# Altium project UAARG Autopilot.PrjPcb (part 2 of 3)

## Sheet IMU.SchDoc
size A; DocumentNumber: 5; SheetNumber: 5; SheetTotal: 16
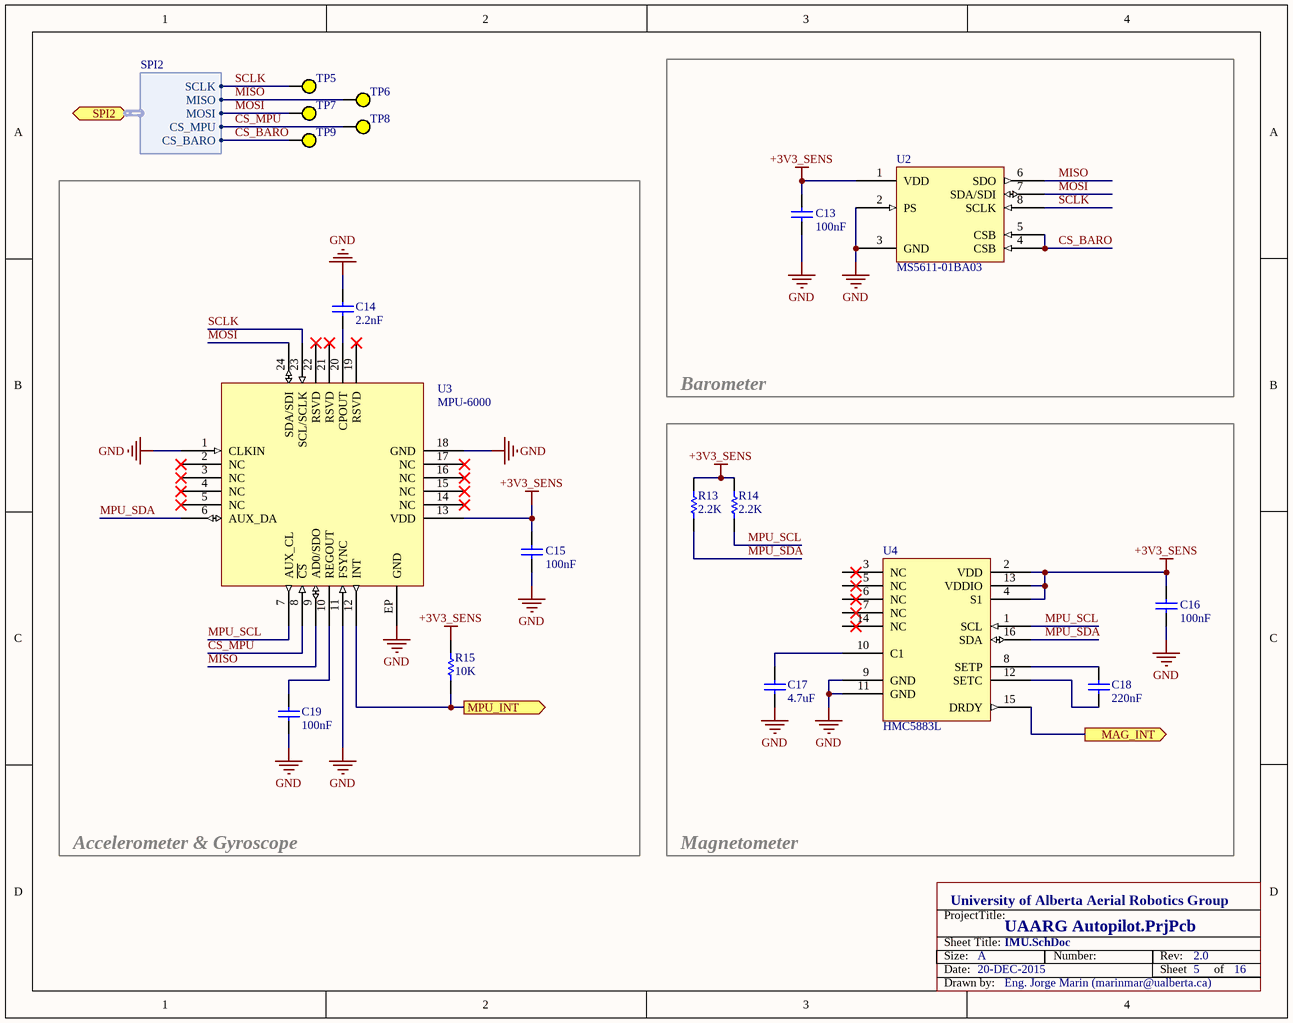
[diagram p9: IMU.SchDoc]

### Parts
C13  value 100nF  [CAP_0402[1005M]]  (hidden comment: Cap)
C14  value 2.2nF  [CAP_0402[1005M]]  (hidden comment: CAP)
C15  value 100nF  [CAP_0402[1005M]]  (hidden comment: Cap)
C16  value 100nF  [CAP_0402[1005M]]  (hidden comment: Cap)
C17  value 4.7uF  [CAP_0402[1005M]]  (hidden comment: Cap)
C18  value 220nF  [CAP_0402[1005M]]  (hidden comment: Cap)
C19  value 100nF  [CAP_0402[1005M]]  (hidden comment: Cap)
R13  value 2.2K  [RES_0402[1005M]]  (hidden comment: RES)
R14  value 2.2K  [RES_0402[1005M]]  (hidden comment: RES)
R15  value 10K  [RES_0402[1005M]]  (hidden comment: RES)
TP5  Test Point SIG  [TP_SMD_1_SILK]  (value not drawn)  (no BOM)
TP6  Test Point SIG  [TP_SMD_1_SILK]  (value not drawn)  (no BOM)
TP7  Test Point SIG  [TP_SMD_1_SILK]  (value not drawn)  (no BOM)
TP8  Test Point SIG  [TP_SMD_1_SILK]  (value not drawn)  (no BOM)
TP9  Test Point SIG  [TP_SMD_1_SILK]  (value not drawn)  (no BOM)
U2  MS5611-01BA03  [MS5611-01BA03]
U3  MPU-6000  [QFN24]
U4  HMC5883L  [QFN16]

### Blocks framed on the sheet
Barometer: C13 U2
Accelerometer & Gyroscope: C14 C15 C19 R15 U3
Magnetometer: C16-C18 R13 R14 U4

### Ports
MAG_INT (out), MPU_INT (out), SPI2 (harness SPI2)

### Harnesses
SPI2: SCLK, MOSI, MISO, CS_MPU, CS_BARO

### Nets
+3V3_SENS: C13.1 C15.1 C16.1 R13.2 R14.2 R15.2 U2.1(VDD) U3.13(VDD) U4.2(VDD) U4.4(S1) U4.13(VDDIO)
GND: C13.2 C14.2 C15.2 C16.2 C17.2 C19.1 U2.2(PS) U2.3(GND) U3.1(CLKIN) U3.11(FSYNC) U3.18(GND) U3.EP(GND) U4.9(GND) U4.11(GND)
CS_BARO: TP9.1 U2.4(CSB) U2.5(CSB) ; port SPI2.CS_BARO
CS_MPU: TP8.1 U3.8(~{CS}) ; port SPI2.CS_MPU
MAG_INT: U4.15(DRDY) ; port MAG_INT
MISO: TP6.1 U2.6(SDO) U3.9(AD0/SDO) ; port SPI2.MISO
MOSI: TP7.1 U2.7(SDA/SDI) U3.24(SDA/SDI) ; port SPI2.MOSI
MPU_INT: R15.1 U3.12(INT) ; port MPU_INT
MPU_SCL: R14.1 U3.7(AUX_CL) U4.1(SCL)
MPU_SDA: R13.1 U3.6(AUX_DA) U4.16(SDA)
SCLK: TP5.1 U2.8(SCLK) U3.23(SCL/SCLK) ; port SPI2.SCLK  [project net PB13]
NetC14_1: C14.1 U3.20(CPOUT)
NetC17_1: C17.1 U4.10(C1)
NetC18_1: C18.1 U4.8(SETP)
NetC18_2: C18.2 U4.12(SETC)
NetC19_2: C19.2 U3.10(REGOUT)

Not connected (* = marked no-connect by the designer): U3 2(NC)* 3(NC)* 4(NC)* 5(NC)* 14(NC)* 15(NC)* 16(NC)* 17(NC)* 19(RSVD)* 21(RSVD)* 22(RSVD)*; U4 3(NC) 5(NC) 6(NC) 7(NC) 14(NC)

### Notes on the sheet
- Sheet Title:
- ProjectTitle:
- Size:
- Date:
- A
- Number:
- Rev:
- Sheet         of
- Drawn by:

### Library data of the parts
C13 C15 C16 C19 = Cap: as C20 on sheet CAN, JTAG, LDO, USB; Supplier 1: Digi-Key; Supplier Part Number 1: 311-1345-1-ND; ComponentLink1URL: http://www.yageo.com/documents/recent/UPY-GPHC_X7R_6.3V-to-50V-v12.pdf; ComponentLink1Description: Datasheet
C14 = CAP: Capacitor; Manufacturer: Yageo; Manufacturer Part Number: CC0402KRX7R9BB222; Supplier 1: Digi-Key; Supplier Part Number 1: 311-1037-1-ND; ComponentLink1URL: http://www.yageo.com/documents/recent/UPY-GPHC_X7R_6.3V-to-50V-v12.pdf; ComponentLink1Description: Datasheet
C17 = Cap: Capacitor; Manufacturer: Yageo; Manufacturer Part Number: CC0402MRX5R6BB475; Supplier 1: Digi-Key; Supplier Part Number 1: 311-1734-1-ND; ComponentLink1URL: http://www.yageo.com/documents/recent/UPY-GPHC_X5R_4V-to-50V_19.pdf; ComponentLink1Description: Datasheet
C18 = Cap: Capacitor; Manufacturer: Yageo; Manufacturer Part Number: CC0402KRX5R5BB224; Supplier 1: Digi-Key; Supplier Part Number 1: 311-1681-1-ND; ComponentLink1URL: http://www.yageo.com/documents/recent/UPY-GPHC_X5R_4V-to-50V_19.pdf; ComponentLink1Description: Datasheet
R13 R14 = RES: Resistor; Manufacturer Part Number: RC0402FR-072K2L; Manufacturer: Yageo; Supplier 1: Digi-Key; Supplier Part Number 1: 311-2.20KLRCT-ND; ComponentLink1URL: http://www.yageo.com/NewPortal/yageodocoutput?fileName=/pdf/R-Chip/PYu-RC_Group_51_RoHS_L_3.pdf; ComponentLink1Description: Datasheet
R15 = RES: Resistor; Manufacturer: Yageo; Manufacturer Part Number: RC0402FR-0710KL; Supplier 1: Digi-Key; Supplier Part Number 1: 311-10.0KLRCT-ND; ComponentLink1URL: http://www.yageo.com/NewPortal/yageodocoutput?fileName=/pdf/R-Chip/PYu-RC_Group_51_RoHS_L_3.pdf; ComponentLink1Description: Datasheet
TP5-TP9 = Test Point SIG: Test Point Signal
U2 = MS5611-01BA03: MS5611-01BA03 Barometer, Altimeter; Manufacturer: Measurement Specialties, Inc.; Manufacturer Part Number: MS5611-01BA03; Supplier 2: Component Distributors, Inc.; Supplier Part Number 2: MS5611-01BA03; Supplier 4: Newark; Supplier Part Number 4: 20X0212; ComponentLink1URL: http://www.mouser.com/ds/2/418/MS5611-01BA03-769655.pdf; ComponentLink1Description: Datasheet; Supplier 3: Mouser; Supplier Part Number 3: 824-MS561101BA03-00; Supplier 1: Digi-Key; Supplier Part Number 1: 223-1622-1-ND
U3 = MPU-6000: Invense MPU-6000 6 Axis Motion Sensor; Manufacturer: InvenSense; Manufacturer Part Number: MPU-6000; Supplier 2: InvenSense; Supplier Part Number 2: MPU-6000; Supplier 1: Digi-Key; Supplier Part Number 1: 1428-1005-2-ND; ComponentLink1URL: http://store.invensense.com/datasheets/invensense/MPU-6050_DataSheet_V3%204.pdf; ComponentLink1Description: Datasheet
U4 = HMC5883L: HMC5883L 3-axis Magnetometer; Manufacturer: Honeywell Microelectronics & Precision Sensors; Manufacturer Part Number: HMC5883L-TR; Supplier 1: Digi-Key; Supplier Part Number 1: 342-1082-1-ND; ComponentLink1URL: http://www51.honeywell.com/aero/common/documents/myaerospacecatalog-documents/Defense_Brochures-documents/HMC5883L_3-Axis_Digital_Compass_IC.pdf; ComponentLink1Description: Datasheet

## Sheet GPS.SchDoc
size A; DocumentNumber: 6; SheetNumber: 6; SheetTotal: 16
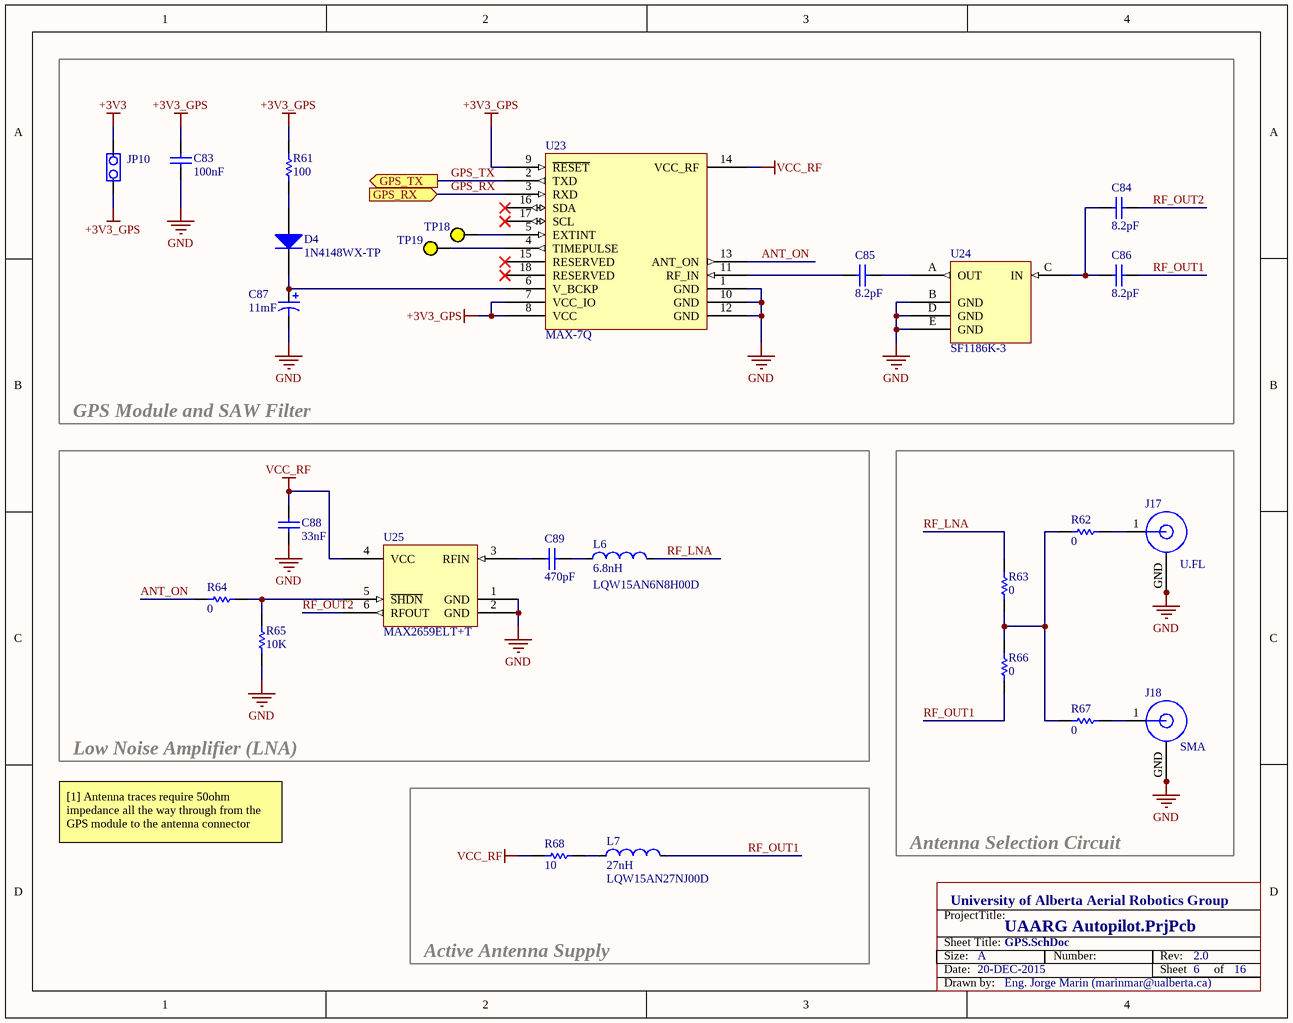
[diagram p10: GPS.SchDoc]

### Parts
C83  value 100nF  [CAP_0402[1005M]]  (hidden comment: Cap)
C84  value 8.2pF  [CAP_0402[1005M]]  (hidden comment: Cap)
C85  value 8.2pF  [CAP_0402[1005M]]  (hidden comment: Cap)
C86  value 8.2pF  [CAP_0402[1005M]]  (hidden comment: Cap)
C87  value 11mF  [SUPERCAP_1210[3225M]]  (hidden comment: CAP_POL)
C88  value 33nF  [CAP_0402[1005M]]  (hidden comment: Cap)
C89  value 470pF  [CAP_0402[1005M]]  (hidden comment: Cap)
D4  Manufacturer Part Number: 1N4148WX-TP  [SOD-323]  (hidden comment: DIODE)
J17  U.FL  [U.FL_1]
J18  SMA  [SMA]
JP10  Jumper  [HDR_1x02_JMP]  (value not drawn)  (no BOM)
L6  6.8nH  Manufacturer Part Number: LQW15AN6N8H00D  [GEN_0402[1005M]]
L7  27nH  Manufacturer Part Number: LQW15AN27NJ00D  [GEN_0402[1005M]]
R61  value 100  [RES_0402[1005M]]  (hidden comment: RES)
R62  value 0  [RES_0402[1005M]]  (hidden comment: RES)
R63  value 0  [RES_0402[1005M]]  (hidden comment: RES)
R64  value 0  [RES_0402[1005M]]  (hidden comment: RES)
R65  value 10K  [RES_0402[1005M]]  (hidden comment: RES)
R66  value 0  [RES_0402[1005M]]  (hidden comment: RES)
R67  value 0  [RES_0402[1005M]]  (hidden comment: RES)
R68  value 10  [RES_0402[1005M]]  (hidden comment: RES)
TP18  Test Point SIG  [TP_SMD_1_SILK]  (value not drawn)  (no BOM)
TP19  Test Point SIG  [TP_SMD_1_SILK]  (value not drawn)  (no BOM)
U23  MAX-7Q  [MAX6/7_GPS]
U24  SF1186K-3  [5-SMD]
U25  MAX2659ELT+T  [uDFN-6]

### Blocks framed on the sheet
GPS Module and SAW Filter: C83-C87 D4 JP10 R61 TP18 TP19 U23 U24
Low Noise Amplifier (LNA): C88 C89 L6 R64 R65 U25
Antenna Selection Circuit: J17 J18 R62 R63 R66 R67
Active Antenna Supply: L7 R68

### Ports
GPS_RX (in), GPS_TX (out)

### Nets
+3V3: JP10.2
+3V3_GPS: C83.2 JP10.1 R61.1 U23.7(VCC_IO) U23.8(VCC) U23.9(~{RESET})
GND: C83.1 C87.2 C88.2 J17.GND J18.GND R65.1 U23.1(GND) U23.10(GND) U23.12(GND) U24.B(GND) U24.D(GND) U24.E(GND) U25.1(GND) U25.2(GND)
VCC_RF: C88.1 R68.1 U23.14(VCC_RF) U25.4(VCC)
ANT_ON: R64.1 U23.13(ANT_ON)
GPS_RX: U23.3(RXD) ; port GPS_RX
GPS_TX: U23.2(TXD) ; port GPS_TX
RF_LNA: L6.2 R63.2
RF_OUT1: C86.1 L7.2 R66.1
RF_OUT2: C84.1 U25.6(RFOUT)
NetC84_2: C84.2 C86.2 U24.C(IN)
NetC85_1: C85.1 U24.A(OUT)
NetC85_2: C85.2 U23.11(RF_IN)
NetC87_1: C87.1 D4.2(K) U23.6(V_BCKP)
NetC89_1: C89.1 L6.1
NetC89_2: C89.2 U25.3(RFIN)
NetD4_1: D4.1(A) R61.2
NetJ17_1: J17.1(OSC1) R62.1
NetJ18_1: J18.1(OSC1) R67.1
NetL7_1: L7.1 R68.2
NetR62_2: R62.2 R63.1 R66.2 R67.2
NetR64_2: R64.2 R65.2 U25.5(~{SHDN})
NetTP18_1: TP18.1 U23.5(EXTINT)
NetTP19_1: TP19.1 U23.4(TIMEPULSE)

Not connected (* = marked no-connect by the designer): U23 15(RESERVED)* 16(SDA)* 17(SCL)* 18(RESERVED)*

### Notes on the sheet
- [1] Antenna traces require 50ohm impedance all the way through from the GPS module to the antenna connector
- Sheet Title:
- ProjectTitle:
- Size:
- Date:
- A
- Number:
- Rev:
- Sheet         of
- Drawn by:

### Library data of the parts
C83 = Cap: as C20 on sheet CAN, JTAG, LDO, USB; Supplier 1: Digi-Key; Supplier Part Number 1: 311-1345-1-ND; ComponentLink1URL: http://www.yageo.com/documents/recent/UPY-GPHC_X7R_6.3V-to-50V-v12.pdf; ComponentLink1Description: Datasheet
C84-C86 = Cap: Capacitor; Manufacturer: Yageo; Manufacturer Part Number: CC0402BRNPO9BN8R2; Supplier 1: Digi-Key; Supplier Part Number 1: 311-1628-1-ND; ComponentLink1URL: http://www.yageo.com/documents/recent/UPY-GP_NP0_16V-to-50V_10.pdf; ComponentLink1Description: Datasheet
C87 = CAP_POL: Polarized Capacitor; Manufacturer: Seiko Instruments; Manufacturer Part Number: CPH3225A; Supplier 1: Digi-Key; Supplier Part Number 1: 728-1067-1-ND; ComponentLink1URL: http://media.digikey.com/pdf/Data%20Sheets/Seiko%20Instruments%20PDFs/CPH3225A_CP3225A.pdf; ComponentLink1Description: Datasheet
C88 = Cap: Capacitor; Manufacturer Part Number: CL05B333JO5NNNC; Manufacturer: Samsung Electro-Mechanics America, Inc.; Supplier 1: Digi-Key; Supplier Part Number 1: 1276-1553-1-ND; ComponentLink1URL: http://www.samsungsem.com/kr/support/product-search/mlcc/CL05B333JO5NNNC.jsp; ComponentLink1Description: Datasheet
C89 = Cap: Capacitor; Manufacturer Part Number: C1005C0G1H471J050BA; Manufacturer: TDK Corporation; Supplier 1: Digi-Key; Supplier Part Number 1: 445-2656-1-ND; ComponentLink1URL: http://product.tdk.com/en/catalog/datasheets/mlcc_commercial_general_en.pdf; ComponentLink1Description: Datasheet
D4 = DIODE: Typical Diode; Manufacturer: Micro Commercial Co; Current - Reverse Leakage @ Vr: 5µA @ 75V; Current - Average Rectified (Io): 150mA; Supplier 1: Digi-Key; Supplier Part Number 1: 1N4148WXTPMSCT-ND; ComponentLink1URL: http://www.mccsemi.com/up_pdf/1N4148WX(SOD323).pdf; ComponentLink1Description: Datasheet
J17 = U.FL: U.FL RF connector; Manufacturer: Hirose Electric Co Ltd; Manufacturer Part Number: U.FL-R-SMT(10); Impedance: 50 Ohm; Supplier 1: Digi-Key; Supplier Part Number 1: H9161CT-ND; ComponentLink1URL: http://media.digikey.com/pdf/Data%20Sheets/Hirose%20PDFs/UFL%20Series.pdf; ComponentLink1Description: Datasheet
J18 = U.FL: SMA RF connector; Manufacturer: Cinch Connectivity Solutions Johnson; Manufacturer Part Number: 142-0701-801; Dielectric Material: Polytetrafluoroethylene (PTFE); Frequency - Max: 18GHz; Impedance: 50 Ohm; Connector Type: Jack, Female Socket; Supplier 1: Digi-Key; Supplier Part Number 1: J502-ND; ComponentLink1URL: http://cinchconnectivity.com/OA_MEDIA/drawings/dr-1420701801.pdf; ComponentLink1Description: Datasheet; Fastening Type: Threaded; Connector Style: SMA
L6 = Inductor: Chip Inductor; Manufacturer: Murata Electronics North America; Q @ Freq: 25 @ 250MHz; Frequency - Test: 100MHz; Frequency - Self Resonant: 6GHz; DC Resistance (DCR): 90 mOhm Max; Current Rating: 700mA; Value: 6.8nH; Supplier 1: Digi-Key; Supplier Part Number 1: 490-6841-1-ND; ComponentLink1URL: http://search.murata.co.jp/Ceramy/image/img/PDF/ENG/L0075S0080LQW15A_00.pdf; ComponentLink1Description: Datasheet
L7 = Inductor: Chip Inductor; Manufacturer: Murata Electronics North America; Q @ Freq: 25 @ 250MHz; DC Resistance (DCR): 520 mOhm Max; Frequency - Self Resonant: 3.5GHz; Frequency - Test: 100MHz; Current Rating: 280mA; Value: 27nH; ComponentLink1URL: http://search.murata.co.jp/Ceramy/image/img/PDF/ENG/L0075S0080LQW15A_00.pdf; ComponentLink1Description: Datasheet; Supplier 1: Digi-Key; Supplier Part Number 1: 490-1151-1-ND
R61 = RES: Resistor; Manufacturer Part Number: RC0402FR-07100RL; Manufacturer: Yageo; Supplier 1: Digi-Key; Supplier Part Number 1: 311-100LRCT-ND; ComponentLink1URL: http://www.yageo.com/NewPortal/yageodocoutput?fileName=/pdf/R-Chip/PYu-RC_Group_51_RoHS_L_3.pdf; ComponentLink1Description: Datasheet
R62-R64 R66 R67 = RES: as R1 on sheet UAARG Autopilot; Supplier 1: Digi-Key; Supplier Part Number 1: 311-0.0JRCT-ND; ComponentLink1URL: http://www.yageo.com/NewPortal/yageodocoutput?fileName=/pdf/R-Chip/PYu-RC_Group_51_RoHS_L_3.pdf; ComponentLink1Description: Datasheet
R65 = RES: as R15 on sheet IMU; Supplier 1: Digi-Key; Supplier Part Number 1: 311-10.0KLRCT-ND; ComponentLink1URL: http://www.yageo.com/NewPortal/yageodocoutput?fileName=/pdf/R-Chip/PYu-RC_Group_51_RoHS_L_3.pdf; ComponentLink1Description: Datasheet
R68 = RES: Resistor; Manufacturer: Yageo; Manufacturer Part Number: RC0402FR-0710RL; Supplier 1: Digi-Key; Supplier Part Number 1: 311-10.0LRCT-ND; ComponentLink1URL: http://www.yageo.com/NewPortal/yageodocoutput?fileName=/pdf/R-Chip/PYu-RC_Group_51_RoHS_L_3.pdf; ComponentLink1Description: Datasheet
TP18 TP19 = Test Point SIG: Test Point Signal
U23 = MAX-7Q: u-blox MAX-7Q GNSS Module; Manufacturer: u-blox; Supplier 1: u-blox; Supplier Part Number 1: MAX-7Q; Manufacturer Part Number: MAX-7Q; ComponentLink1Description: Datasheet; ComponentLink1URL: https://www.u-blox.com/sites/default/files/products/documents/MAX-7_DataSheet_(UBX-13004068).pdf; ComponentLink2Description: Manufacturer URL; ComponentLink2URL: https://www.u-blox.com/en/product/max-7-series
U24 = SF1186K-3: GPS SAW Filter; Manufacturer: Murata Electronics North America; Bandwidth: 40MHz; Insertion Loss: 0.9dB; Filter Type: Band Pass; Frequency: 1575.42MHz Center; Supplier 1: Digi-Key; Supplier Part Number 1: 583-1182-1-ND; Package / Case: 5-SMD, No Lead; Applications: GPS; Manufacturer Part Number: SF1186K-3; Size / Dimension: 0.057" L x 0.045" W (1.45mm x 1.15mm); ComponentLink1URL: http://www.rfmchina.com/prouplod/prodt/sf1186k-3.pdf; ComponentLink1Description: Datasheet
U25 = MAX2659: MAX2659 Low Noise Amplifier; Manufacturer: Maxim Integrated; Gain: 20.5dB; Frequency: 1575.42MHz; Current - Supply: 4.1mA; Voltage - Supply: 1.6 V ~ 3.3 V; Supplier 1: Digi-Key; Supplier Part Number 1: MAX2659ELT+TCT-ND; Manufacturer Part Number: MAX2659ELT+T; Package / Case: 6-WFDFN; ComponentLink1URL: http://datasheets.maximintegrated.com/en/ds/MAX2659.pdf; ComponentLink1Description: Datasheet

## Sheet Connectors.SchDoc
size 355 x 228 mm; DocumentNumber: 3; SheetNumber: 3; SheetTotal: 16
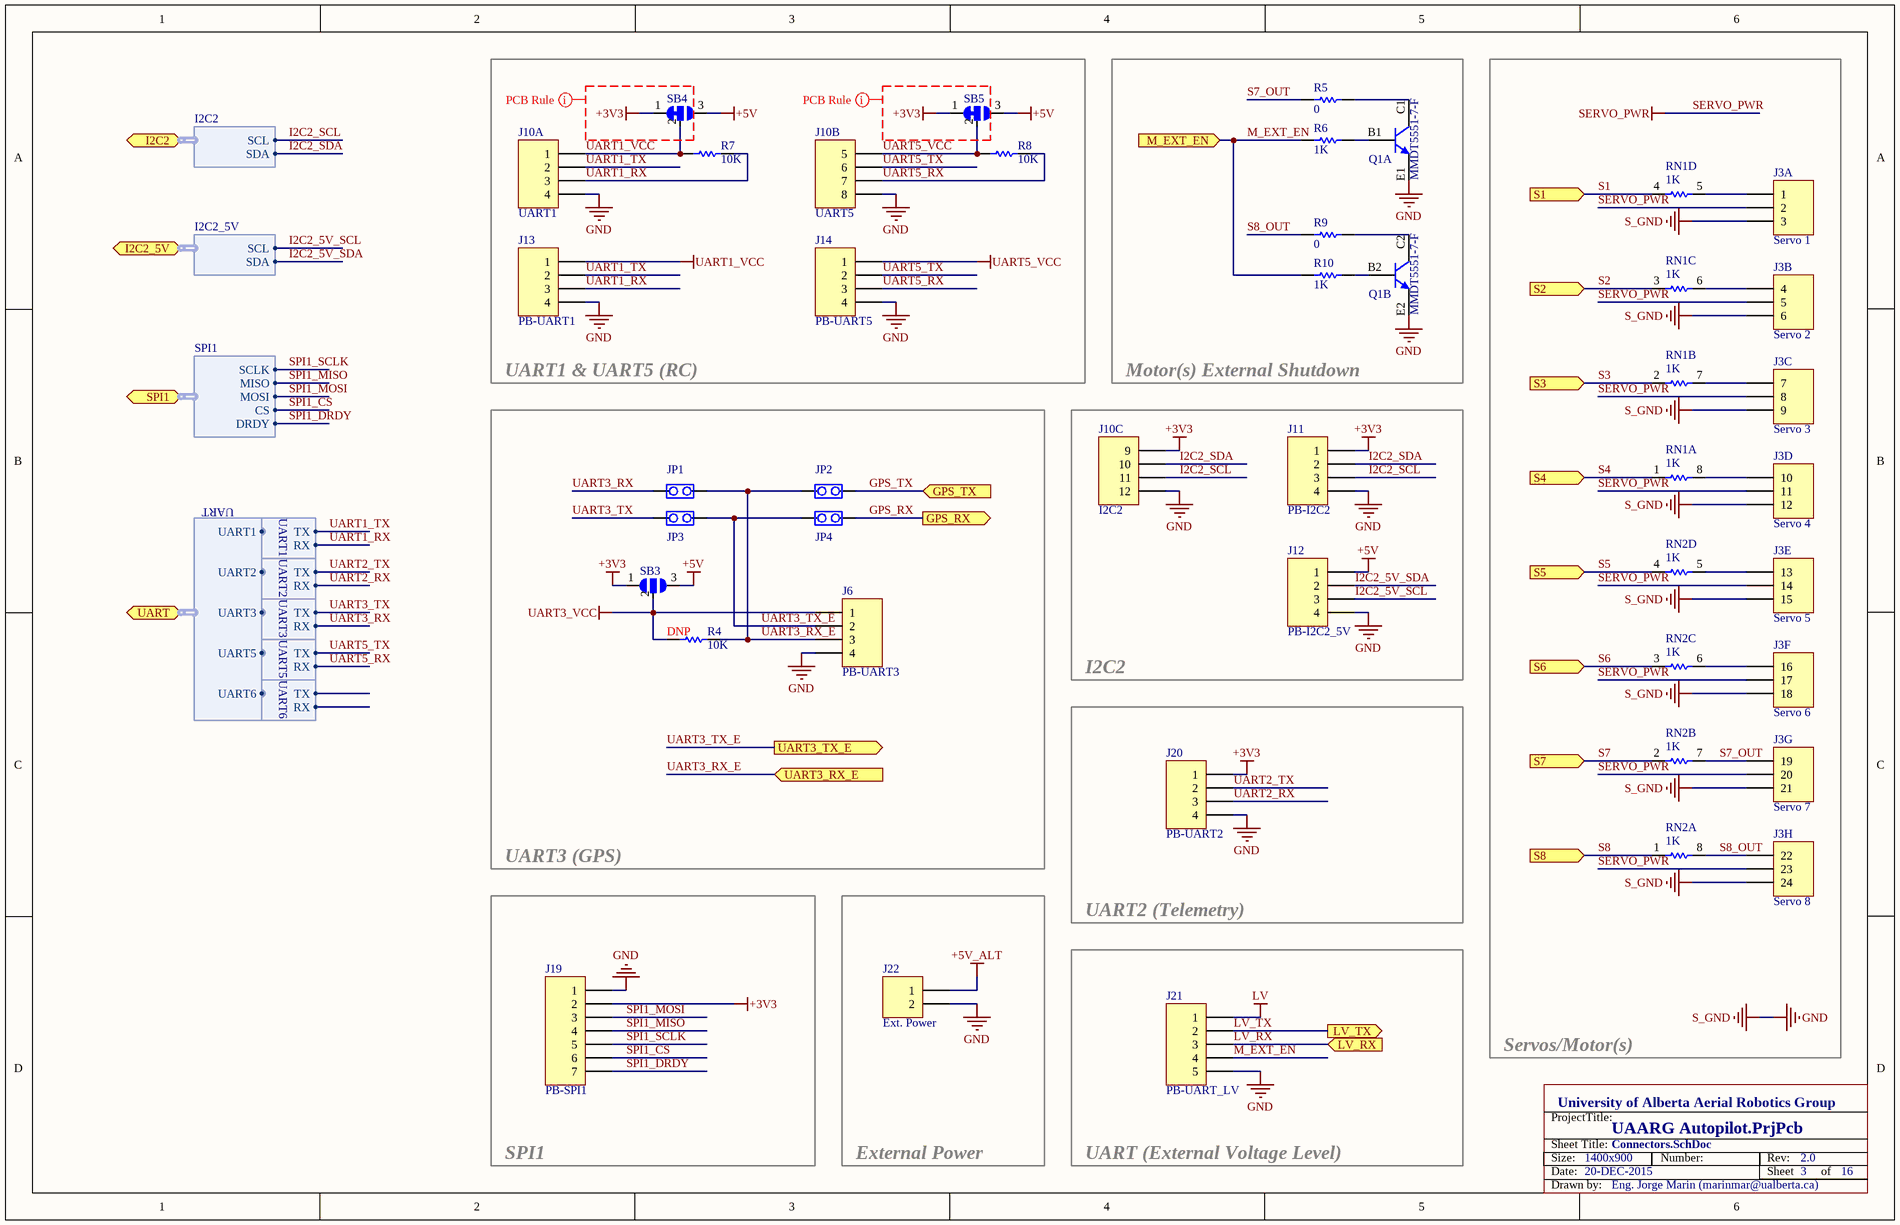
[diagram p11: Connectors.SchDoc]

### Parts
J3  Servo  [HDR_3x08_RA]  (value not drawn)  (parts A,B,C,D,E,F,G,H of 8)  (no BOM)
J6  PB-UART3  [PICOBLADE_1X04_VERT_SMD]
J10  Header  [HDR_3x04_RA]  (value not drawn)  (parts A,B,C of 3)  (no BOM)
J11  PB-I2C2  [PICOBLADE_1X04_VERT_SMD]
J12  PB-I2C2_5V  [PICOBLADE_1X04_VERT_SMD]
J13  PB-UART1  [PICOBLADE_1X04_VERT_SMD]
J14  PB-UART5  [PICOBLADE_1X04_VERT_SMD]
J19  PB-SPI1  [PICOBLADE_1X07_VERT_SMD]
J20  PB-UART2  [PICOBLADE_1X04_VERT_SMD]
J21  PB-UART_LV  [PICOBLADE_1X05_VERT_SMD]
J22  Ext. Power  [HDR_1x02]  (no BOM)
JP1  Jumper  [HDR_1x02_JMP]  (value not drawn)  (no BOM)
JP2  Jumper  [HDR_1x02_JMP]  (value not drawn)  (no BOM)
JP3  Jumper  [HDR_1x02_JMP]  (value not drawn)  (no BOM)
JP4  Jumper  [HDR_1x02_JMP]  (value not drawn)  (no BOM)
Q1  Manufacturer Part Number: MMDT5551-7-F  [SOT363-6]  (hidden comment: BJT NPN DUAL)  (parts A,B of 2)
R4  value 10K  Note: DNP  [RES_0402[1005M]]  (hidden comment: RES)
R5  value 0  [JUMPER_RES_0402]  (hidden comment: RES)
R6  value 1K  [RES_0402[1005M]]  (hidden comment: RES)
R7  value 10K  [RES_0402[1005M]]  (hidden comment: RES)
R8  value 10K  [RES_0402[1005M]]  (hidden comment: RES)
R9  value 0  [JUMPER_RES_0402]  (hidden comment: RES)
R10  value 1K  [RES_0402[1005M]]  (hidden comment: RES)
RN1  value 1K  [RES ARRAY SMD]  (hidden comment: Res Network 1)  (parts A,B,C,D of 4)
RN2  value 1K  [RES ARRAY SMD]  (hidden comment: Res Network 1)  (parts A,B,C,D of 4)
SB3  SMD Jumper 1  [SMD JUMPER 1]  (value not drawn)  (no BOM)
SB4  SMD Jumper 2  [SMD JUMPER 2]  (value not drawn)  (no BOM)
SB5  SMD Jumper 2  [SMD JUMPER 2]  (value not drawn)  (no BOM)

### Blocks framed on the sheet
UART1 & UART5 (RC): J10 J13 J14 R7 R8 SB4 SB5
Motor(s) External Shutdown: Q1 R5 R6 R9 R10
Servos/Motor(s): J3 RN1 RN2
UART3 (GPS): J6 JP1-JP4 R4 SB3
I2C2: J10-J12
UART2 (Telemetry): J20
SPI1: J19
External Power: J22
UART (External Voltage Level): J21

### Ports
GPS_RX (out), GPS_TX (in), I2C2 (harness I2C2), I2C2_5V (harness I2C2_5V), LV_RX (in), LV_TX (out), M_EXT_EN (in), S1 (in), S2 (in), S3 (in), S4 (in), S5 (in), S6 (in), S7 (in), S8 (in), SPI1 (harness SPI1), UART3_RX_E (in), UART3_TX_E (out), UART (harness UART)

### Harnesses
I2C2: SDA, SCL
I2C2_5V: SDA, SCL
UART2: TX, RX
UART3: TX, RX
UART1: TX, RX
UART5: TX, RX
UART6: TX, RX
UART: UART1, UART2, UART3, UART5, UART6
SPI1: SCLK, MOSI, MISO, CS, DRDY

### Nets
+3V3: J10.9 J11.1 J19.2 J20.1 SB3.1 SB4.1 SB5.1
+5V: J12.1 SB3.3 SB4.3 SB5.3
+5V_ALT: J22.1
GND: J3.3 J3.6 J3.9 J3.12 J3.15 J3.18 J3.21 J3.24 J6.4 J10.4 J10.8 J10.12 J11.4 J12.4 J13.4 J14.4 J19.1 J20.4 J21.5 J22.2 Q1.E1 Q1.E2  [also labelled S_GND]
LV: J21.1
SERVO_PWR: J3.2 J3.5 J3.8 J3.11 J3.14 J3.17 J3.20 J3.23
UART1_VCC: J10.1 J13.1 R7.2 SB4.2
UART3_VCC: J6.1 R4.2 SB3.2
UART5_VCC: J10.5 J14.1 R8.2 SB5.2
GPS_RX: JP4.1 ; port GPS_RX
GPS_TX: JP2.1 ; port GPS_TX
I2C2_5V_SCL: J12.3 ; port I2C2_5V.SCL  [project net I2C2_5V.SCL]
I2C2_5V_SDA: J12.2 ; port I2C2_5V.SDA  [project net I2C2_5V.SDA]
I2C2_SCL: J10.11 J11.3 ; port I2C2.SCL  [project net I2C2.SCL]
I2C2_SDA: J10.10 J11.2 ; port I2C2.SDA  [project net I2C2.SDA]
LV_RX: J21.3 ; port LV_RX
LV_TX: J21.2 ; port LV_TX
M_EXT_EN: J21.4 R6.2 R10.2 ; port M_EXT_EN
S1: RN1.4 ; port S1
S2: RN1.3 ; port S2
S3: RN1.2 ; port S3
S4: RN1.1 ; port S4
S5: RN2.4 ; port S5
S6: RN2.3 ; port S6
S7: RN2.2 ; port S7
S7_OUT: J3.19 R5.2 RN2.7
S8: RN2.1 ; port S8
S8_OUT: J3.22 R9.2 RN2.8
SPI1_CS: J19.6 ; port SPI1.CS  [project net PA4]
SPI1_DRDY: J19.7 ; port SPI1.DRDY  [project net PB1]
SPI1_MISO: J19.4 ; port SPI1.MISO  [project net PA6]
SPI1_MOSI: J19.3 ; port SPI1.MOSI  [project net PA7]
SPI1_SCLK: J19.5 ; port SPI1.SCLK  [project net PA5]
UART1_RX: J10.3 J13.3 R7.1 ; harness UART1.RX  [project net PA10]
UART1_TX: J10.2 J13.2 ; harness UART1.TX  [project net PA9]
UART2_RX: J20.3 ; harness UART2.RX  [project net PA3]
UART2_TX: J20.2 ; harness UART2.TX  [project net PA2]
UART3_RX: JP1.1 ; harness UART3.RX  [project net PC11]
UART3_RX_E: J6.3 JP1.2 JP2.2 R4.1 ; port UART3_RX_E
UART3_TX: JP3.1 ; harness UART3.TX  [project net PC10]
UART3_TX_E: J6.2 JP3.2 JP4.2 ; port UART3_TX_E
UART5_RX: J10.7 J14.3 R8.1 ; harness UART5.RX  [project net PD2]
UART5_TX: J10.6 J14.2 ; harness UART5.TX  [project net PC12]
NetJ3_1: J3.1 RN1.5
NetJ3_4: J3.4 RN1.6
NetJ3_7: J3.7 RN1.7
NetJ3_10: J3.10 RN1.8
NetJ3_13: J3.13 RN2.5
NetJ3_16: J3.16 RN2.6
NetQ1_B1: Q1.B1 R6.1
NetQ1_B2: Q1.B2 R10.1
NetQ1_C1: Q1.C1 R5.1
NetQ1_C2: Q1.C2 R9.1

### Layout directives
rule Short-Circuit Constraint [Short Circuit - Allowed]: +3V3

### Notes on the sheet
- (near J10) UART1
- (near J10) UART5
- (near J3) Servo 1
- (near J3) Servo 2
- (near J3) Servo 3
- (near J10) I2C2
- (near J3) Servo 4
- (near J3) Servo 5
- (near J3) Servo 6
- (near J3) Servo 7
- (near J3) Servo 8
- Sheet Title:
- ProjectTitle:
- Size:
- Date:
- 1400x900
- Number:
- Rev:
- Sheet         of
- Drawn by:

### Library data of the parts
J3 = Header 3X08 RA: Header, 24-Pin
J6 J11-J14 J20 = Header 4: Header, 4-Pin; Manufacturer: Molex, LLC; Manufacturer Part Number: 0533980471; Supplier 1: Digi-Key; Supplier Part Number 1: WM7608CT-ND; ComponentLink1URL: http://www.molex.com/pdm_docs/sd/533980471_sd.pdf; ComponentLink1Description: Datasheet
J10 = Header 3X04 RA: Header, 12-Pin
J19 = Header 7: Header, 7-Pin; Manufacturer: Molex, LLC; Manufacturer Part Number: 0533980771; Supplier 1: Digi-Key; Supplier Part Number 1: WM7611CT-ND; ComponentLink1URL: http://www.molex.com/pdm_docs/sd/533980771_sd.pdf; ComponentLink1Description: Datasheet
J21 = Header 5: Header, 5-Pin; Manufacturer Part Number: 0533980571; Manufacturer: Molex, LLC; Supplier 1: Digi-Key; Supplier Part Number 1: WM7609CT-ND; ComponentLink1URL: http://www.molex.com/pdm_docs/sd/533980571_sd.pdf; ComponentLink1Description: Datasheet
J22 = Header 2: Header, 2-Pin
Q1 = BJT NPN DUAL: NPN General Purpose Amplifier; pin to pad: B1>5 B2>2 C1>3 C2>6 E1>4 E2>1; Manufacturer: Diodes Incorporated; Current - Collector (Ic) (Max): 200mA; DC Current Gain (hFE) (Min) @ Ic, Vce: 80 @ 10mA, 5V; Power - Max: 200mW; Vce Saturation (Max) @ Ib, Ic: 200mV @ 5mA, 50mA; Current - Collector Cutoff (Max): 50nA (ICBO); Voltage - Collector Emitter Breakdown (Max): 160V; Frequency - Transition: 300MHz; Supplier 1: Digi-Key; Supplier Part Number 1: MMDT5551-FDICT-ND; ComponentLink1URL: http://www.diodes.com/_files/datasheets/ds30172.pdf; ComponentLink1Description: Datasheet
R4 R7 R8 = RES: as R15 on sheet IMU; Supplier 1: Digi-Key; Supplier Part Number 1: 311-10.0KLRCT-ND; ComponentLink1URL: http://www.yageo.com/NewPortal/yageodocoutput?fileName=/pdf/R-Chip/PYu-RC_Group_51_RoHS_L_3.pdf; ComponentLink1Description: Datasheet
R5 R9 = RES: as R1 on sheet UAARG Autopilot; Supplier 1: Digi-Key; Supplier Part Number 1: 311-0.0JRCT-ND; ComponentLink1URL: http://www.yageo.com/NewPortal/yageodocoutput?fileName=/pdf/R-Chip/PYu-RC_Group_51_RoHS_L_3.pdf; ComponentLink1Description: Datasheet
R6 R10 = RES: Resistor; Manufacturer: Yageo; Manufacturer Part Number: RC0402FR-071KL; Supplier 1: Digi-Key; Supplier Part Number 1: 311-1.00KLRCT-ND; ComponentLink1URL: http://www.yageo.com/NewPortal/yageodocoutput?fileName=/pdf/R-Chip/PYu-RC_Group_51_RoHS_L_3.pdf; ComponentLink1Description: Datasheet
RN1 RN2 = Res Network 1: Isolated Resistor Network; Manufacturer Part Number: YC164-JR-071KL; Manufacturer: Yageo; Supplier 1: Digi-Key; Supplier Part Number 1: YC164J-1.0KCT-ND; ComponentLink1URL: http://www.yageo.com/NewPortal/yageodocoutput?fileName=/pdf/R-Chip/PYu-YC_TC_group_51_RoHS_L_0.pdf; ComponentLink1Description: Datasheet
SB3 = SMD Jumper 1: SMD Jumper 3 positions. Open
SB4 SB5 = SMD Jumper 2: SMD Jumper 3 positions. Closed

## Sheet Notes.SchDoc
size A; DocumentNumber: 14; SheetNumber: 14; SheetTotal: 16
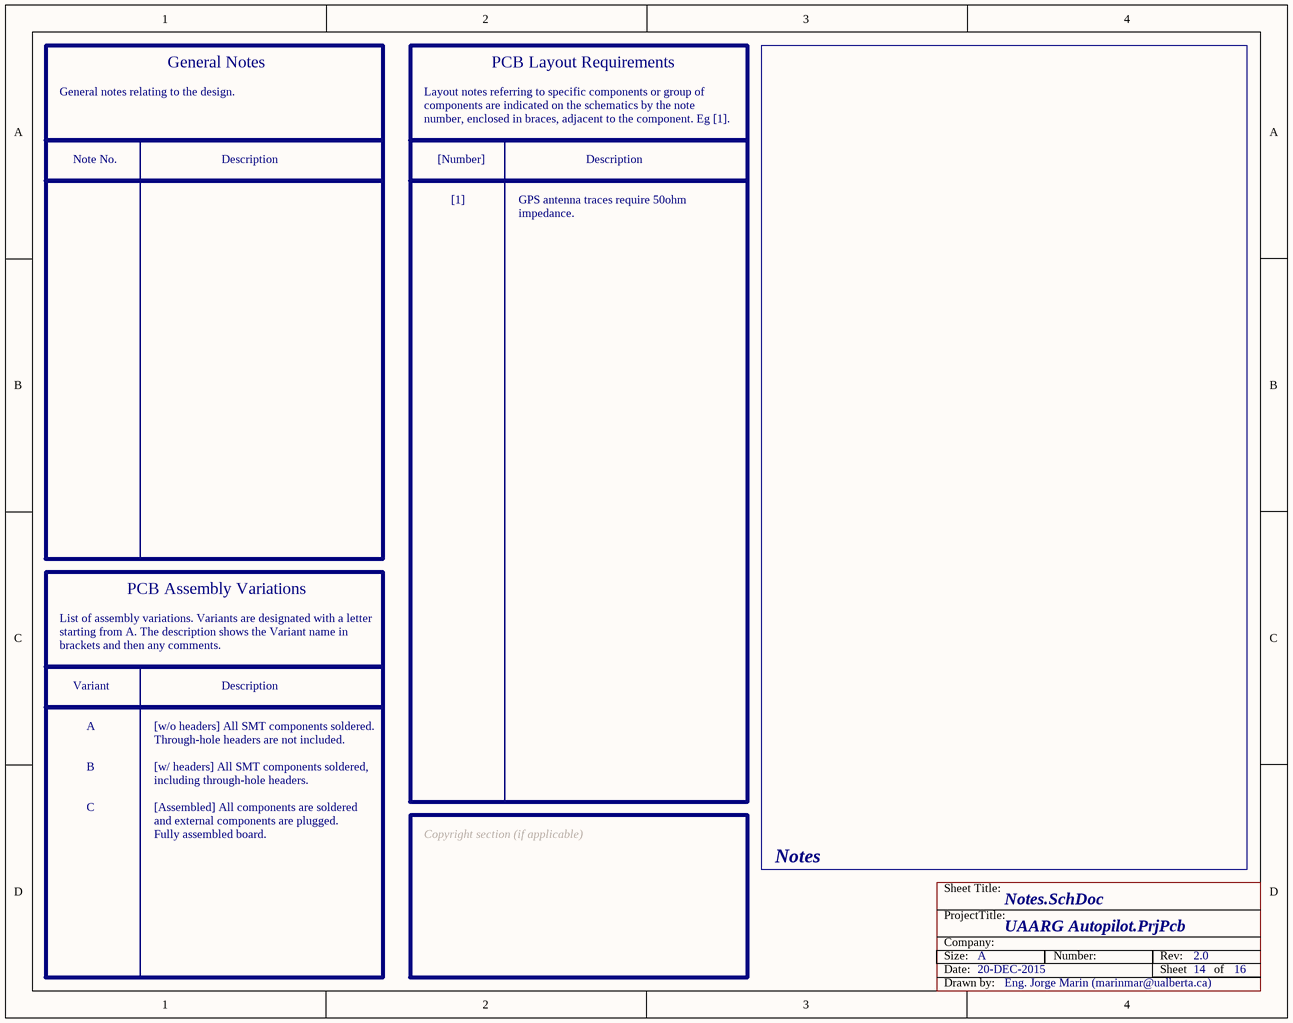
[diagram p12: Notes.SchDoc]

### Notes on the sheet
- General notes relating to the design.
- General Notes
- Layout notes referring to specific components or group of
- PCB Layout Requirements
- Note No.
- Description
- components are indicated on the schematics by the note
- number, enclosed in braces, adjacent to the component. Eg [1].
- [Number]
- [1]
- GPS antenna traces require 50ohm
- impedance.
- List of assembly variations. Variants are designated with a letter
- starting from A. The description shows the Variant name in
- PCB Assembly Variations
- brackets and then any comments.
- Variant
- A
- B
- [w/o headers] All SMT components soldered.
- Through-hole headers are not included.
- [w/ headers] All SMT components soldered,
- C
- including through-hole headers.
- [Assembled] All components are soldered
- and external components are plugged.
- Fully assembled board.
- Copyright section (if applicable)
- Notes
- Sheet Title:
- ProjectTitle:
- Size:
- Date:
- Company:
- Number:
- Rev:
- Sheet         of
- Drawn by:

## Sheet Power.SchDoc
size A; DocumentNumber: 11; SheetNumber: 11; SheetTotal: 16
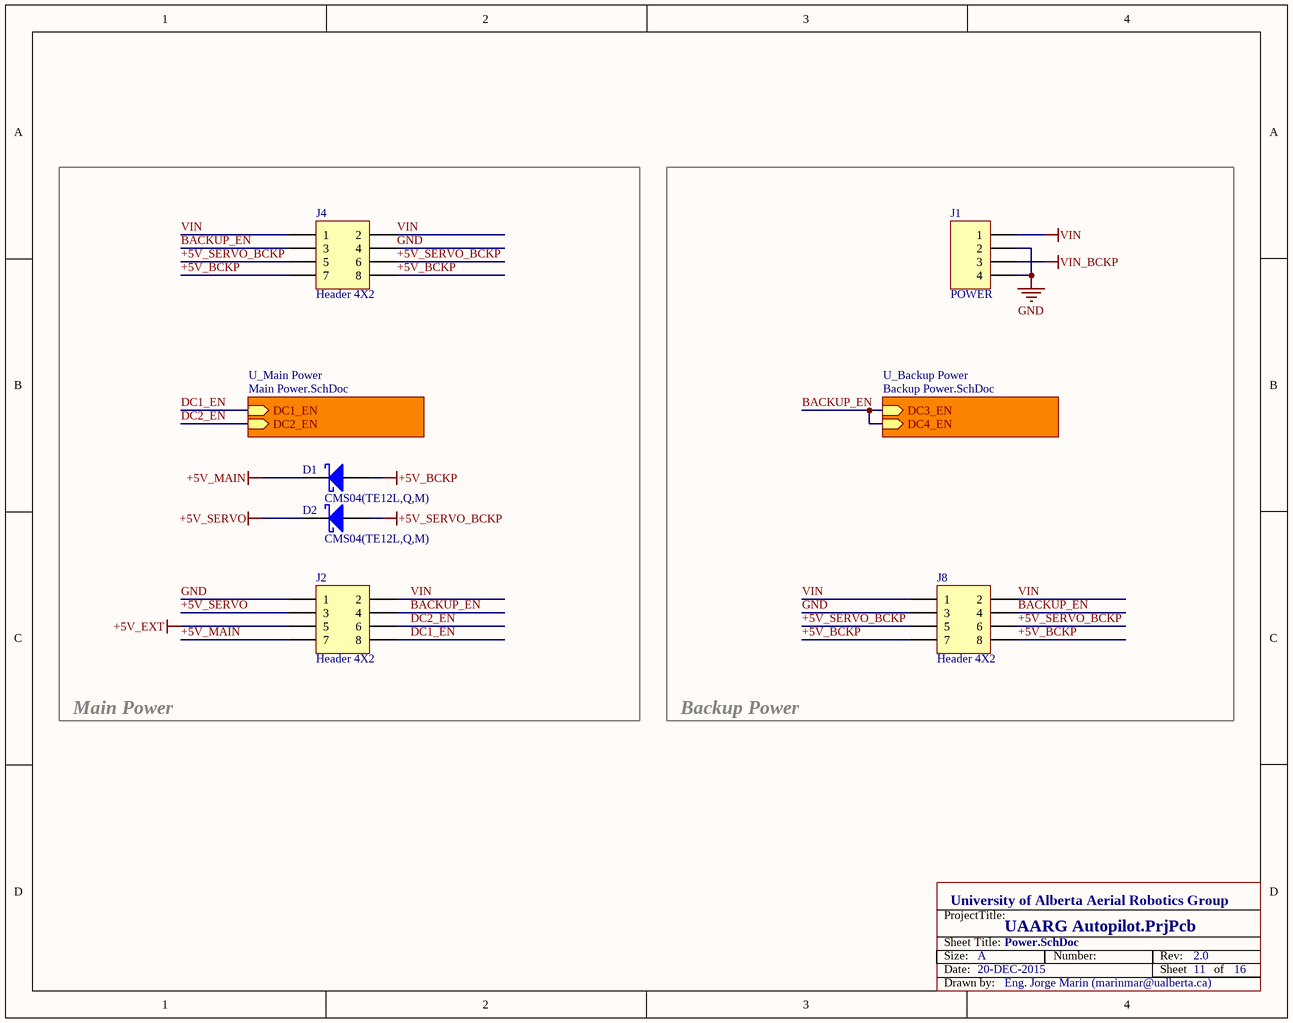
[diagram p13: Power.SchDoc]

### Parts
D1  Manufacturer Part Number: CMS04(TE12L,Q,M)  [SOD-128]  (hidden comment: SCHOTTKY DIODE)
D2  Manufacturer Part Number: CMS04(TE12L,Q,M)  [SOD-128]  (hidden comment: SCHOTTKY DIODE)
J1  POWER  [1X04_v2]  (no BOM)
J2  Header 4X2  [2X04]  (no BOM)
J4  Header 4X2  [2X04]  (no BOM)
J8  Header 4X2  [2X04]  (no BOM)

### Blocks framed on the sheet
Main Power: D1 D2 J2 J4
Backup Power: J1 J8

### Sub-sheets
U_Backup Power = Backup Power.SchDoc: DC3_EN (in), DC4_EN (in)
U_Main Power = Main Power.SchDoc: DC1_EN (in), DC2_EN (in)

### Nets
+5V_BCKP: D1.1(A) J4.7 J4.8 J8.7 J8.8
+5V_EXT: J2.5
+5V_MAIN: D1.2(K) J2.7
+5V_SERVO: D2.2(K) J2.3
+5V_SERVO_BCKP: D2.1(A) J4.5 J4.6 J8.5 J8.6
GND: J1.2 J1.4 J2.1 J4.4 J8.3
VIN: J1.1 J2.2 J4.1 J4.2 J8.1 J8.2
VIN_BCKP: J1.3
BACKUP_EN: J2.4 J4.3 J8.4 ; sheet U_Backup Power/DC3_EN, sheet U_Backup Power/DC4_EN
DC1_EN: J2.8 ; sheet U_Main Power/DC1_EN
DC2_EN: J2.6 ; sheet U_Main Power/DC2_EN

### Notes on the sheet
- Sheet Title:
- ProjectTitle:
- Size:
- Date:
- A
- Number:
- Rev:
- Sheet         of
- Drawn by:

### Library data of the parts
D1 D2 = SCHOTTKY DIODE: Typical Schottky Diode; Manufacturer: Toshiba Semiconductor and Storage; Capacitance @ Vr, F: 330pF @ 10V, 1MHz; Voltage - DC Reverse (Vr) (Max): 30V; Voltage - Forward (Vf) (Max) @ If: 370mV @ 5A; Current - Average Rectified (Io): 5A; Speed: Fast Recovery =< 500ns, > 200mA (Io); Current - Reverse Leakage @ Vr: 8mA @ 30V; Supplier 1: Digi-Key; Supplier Part Number 1: CMS04(TE12LQM)CT-ND; ComponentLink1URL: http://toshiba.semicon-storage.com/info/docget.jsp?did=3133&prodName=CMS04; ComponentLink1Description: Datasheet
J1 = Header 4: Header, 4-Pin
J2 J4 J8 = Header 4X2: Header, 4-Pin, Dual row

## Sheet Main Power.SchDoc
size A; DocumentNumber: 12; SheetNumber: 12; SheetTotal: 16
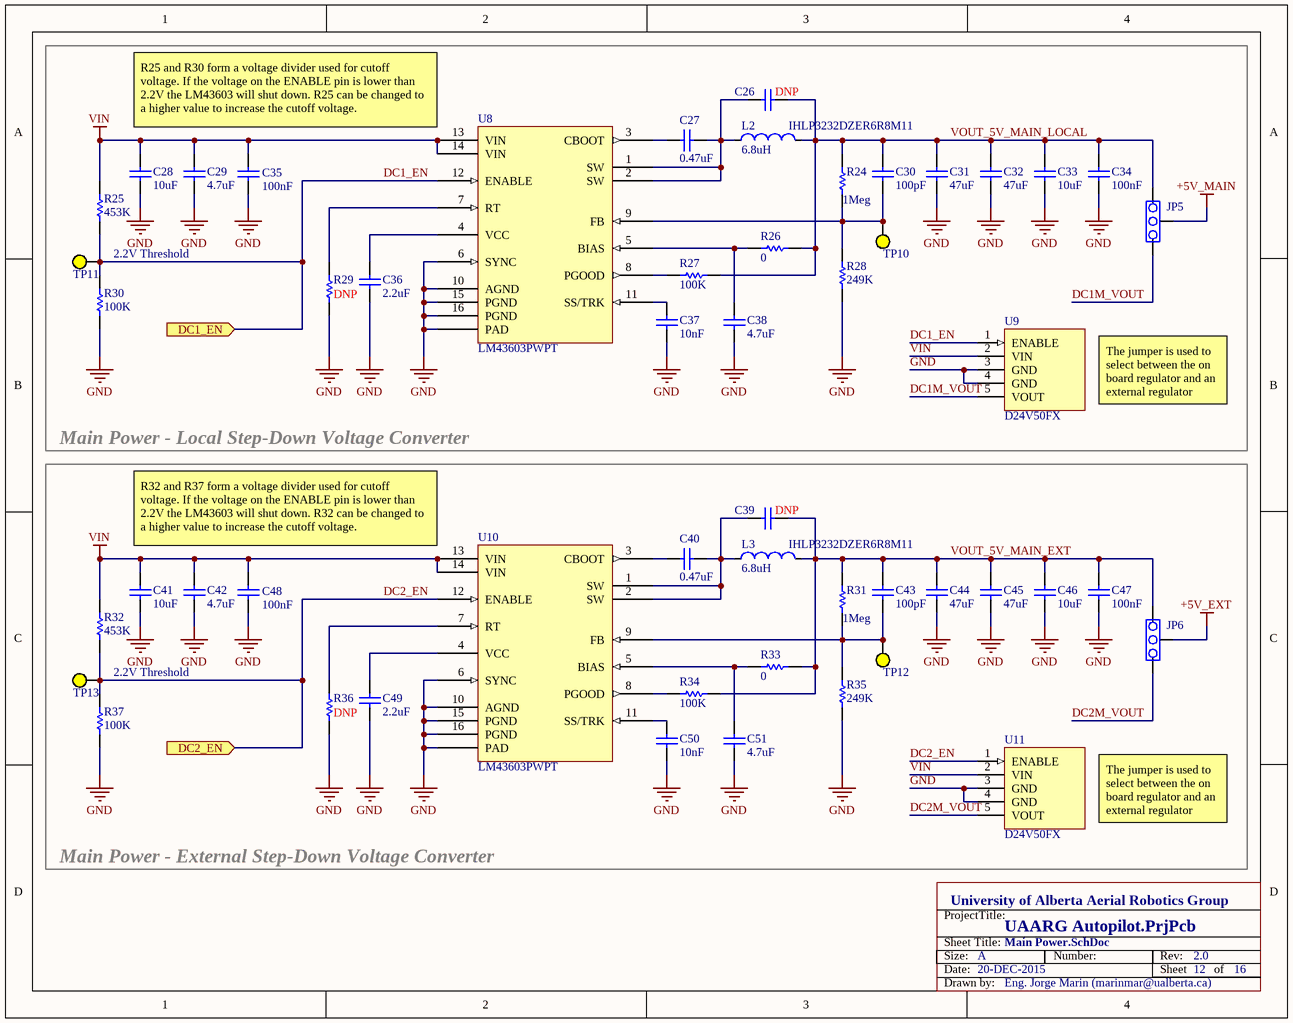
[diagram p14: Main Power.SchDoc]

### Parts
C26  Note: DNP  [CAP_0402[1005M]]  (hidden comment: Cap)
C27  value 0.47uF  [CAP_0402[1005M]]  (hidden comment: Cap)
C28  value 10uF  [CAP_1210[3225M]]  (hidden comment: Cap)
C29  value 4.7uF  [CAP_1210[3225M]]  (hidden comment: Cap)
C30  value 100pF  [CAP_0402[1005M]]  (hidden comment: Cap)
C31  value 47uF  [CAP_1210[3225M]]  (hidden comment: Cap)
C32  value 47uF  [CAP_1210[3225M]]  (hidden comment: Cap)
C33  value 10uF  [CAP_0805[2012M]]  (hidden comment: Cap)
C34  value 100nF  [CAP_0603[1608M]]  (hidden comment: Cap)
C35  value 100nF  [CAP_0402[1005M]]  (hidden comment: Cap)
C36  value 2.2uF  [CAP_0402[1005M]]  (hidden comment: CAP)
C37  value 10nF  [CAP_0402[1005M]]  (hidden comment: Cap)
C38  value 4.7uF  [CAP_0402[1005M]]  (hidden comment: Cap)
C39  Note: DNP  [CAP_0402[1005M]]  (hidden comment: Cap)
C40  value 0.47uF  [CAP_0402[1005M]]  (hidden comment: Cap)
C41  value 10uF  [CAP_1210[3225M]]  (hidden comment: Cap)
C42  value 4.7uF  [CAP_1210[3225M]]  (hidden comment: Cap)
C43  value 100pF  [CAP_0402[1005M]]  (hidden comment: Cap)
C44  value 47uF  [CAP_1210[3225M]]  (hidden comment: Cap)
C45  value 47uF  [CAP_1210[3225M]]  (hidden comment: Cap)
C46  value 10uF  [CAP_0805[2012M]]  (hidden comment: Cap)
C47  value 100nF  [CAP_0603[1608M]]  (hidden comment: Cap)
C48  value 100nF  [CAP_0402[1005M]]  (hidden comment: Cap)
C49  value 2.2uF  [CAP_0402[1005M]]  (hidden comment: CAP)
C50  value 10nF  [CAP_0402[1005M]]  (hidden comment: Cap)
C51  value 4.7uF  [CAP_0402[1005M]]  (hidden comment: Cap)
JP5  Jumper  [JUMPER_3POS]  (value not drawn)  (no BOM)
JP6  Jumper  [JUMPER_3POS]  (value not drawn)  (no BOM)
L2  6.8uH  Manufacturer Part Number: IHLP3232DZER6R8M11  [IHLP-3232DZ]
L3  6.8uH  Manufacturer Part Number: IHLP3232DZER6R8M11  [IHLP-3232DZ]
R24  value 1Meg  [RES_0402[1005M]]  (hidden comment: RES)
R25  value 453K  [RES_0603[1608M]]  (hidden comment: RES)
R26  value 0  [JUMPER_RES_0402]  (hidden comment: RES)
R27  value 100K  [RES_0402[1005M]]  (hidden comment: RES)
R28  value 249K  [RES_0402[1005M]]  (hidden comment: RES)
R29  Note: DNP  [RES_0402[1005M]]  (hidden comment: RES)
R30  value 100K  [RES_0603[1608M]]  (hidden comment: RES)
R31  value 1Meg  [RES_0402[1005M]]  (hidden comment: RES)
R32  value 453K  [RES_0603[1608M]]  (hidden comment: RES)
R33  value 0  [JUMPER_RES_0402]  (hidden comment: RES)
R34  value 100K  [RES_0402[1005M]]  (hidden comment: RES)
R35  value 249K  [RES_0402[1005M]]  (hidden comment: RES)
R36  Note: DNP  [RES_0402[1005M]]  (hidden comment: RES)
R37  value 100K  [RES_0603[1608M]]  (hidden comment: RES)
TP10  Test Point SIG  [TP_SMD_1_SILK]  (value not drawn)  (no BOM)
TP11  Test Point SIG  [TP_TH_1_SILK]  (value not drawn)  (no BOM)
TP12  Test Point SIG  [TP_SMD_1_SILK]  (value not drawn)  (no BOM)
TP13  Test Point SIG  [TP_TH_1_SILK]  (value not drawn)  (no BOM)
U8  LM43603PWPT  [HTSSOP-16]
U9  Manufacturer Part Number: D24V50FX  [D24V__F_]  (hidden comment: D24V__F_)
U10  LM43603PWPT  [HTSSOP-16]
U11  Manufacturer Part Number: D24V50FX  [D24V__F_]  (hidden comment: D24V__F_)

### Blocks framed on the sheet
Main Power - Local Step-Down Voltage Converter: C26-C38 JP5 L2 R24-R30 TP10 TP11 U8 U9
Main Power - External Step-Down Voltage Converter: C39-C51 JP6 L3 R31-R37 TP12 TP13 U10 U11

### Ports
DC1_EN (in), DC2_EN (in)

### Nets
+5V_EXT: JP6.2
+5V_MAIN: JP5.2
GND: C28.2 C29.2 C31.2 C32.2 C33.2 C34.2 C35.2 C36.1 C37.2 C38.2 C41.2 C42.2 C44.2 C45.2 C46.2 C47.2 C48.2 C49.1 C50.2 C51.2 R28.2 R29.1 R30.1 R35.2 R36.1 R37.1 U8.6(SYNC) U8.10(AGND) U8.15(PGND) U8.16(PGND) U8.EP(PAD) U9.3(GND) U9.4(GND) U10.6(SYNC) U10.10(AGND) U10.15(PGND) U10.16(PGND) U10.EP(PAD) U11.3(GND) U11.4(GND)
VIN: C28.1 C29.1 C35.1 C41.1 C42.1 C48.1 R25.2 R32.2 U8.13(VIN) U8.14(VIN) U9.2(VIN) U10.13(VIN) U10.14(VIN) U11.2(VIN)
DC1_EN: R25.1 R30.2 TP11.1 U8.12(ENABLE) U9.1(ENABLE) ; port DC1_EN
DC1M_VOUT: JP5.3 U9.5(VOUT)
DC2_EN: R32.1 R37.2 TP13.1 U10.12(ENABLE) U11.1(ENABLE) ; port DC2_EN
DC2M_VOUT: JP6.3 U11.5(VOUT)
VOUT_5V_MAIN_EXT: C39.2 C43.1 C44.1 C45.1 C46.1 C47.1 JP6.1 L3.2 R31.1 R33.1 R34.1
VOUT_5V_MAIN_LOCAL: C26.2 C30.1 C31.1 C32.1 C33.1 C34.1 JP5.1 L2.2 R24.1 R26.1 R27.1
NetC26_1: C26.1 C27.2 L2.1 U8.1(SW) U8.2(SW)
NetC27_1: C27.1 U8.3(CBOOT)
NetC30_2: C30.2 R24.2 R28.1 TP10.1 U8.9(FB)
NetC36_2: C36.2 U8.4(VCC)
NetC37_1: C37.1 U8.11(SS/TRK)
NetC38_1: C38.1 R26.2 U8.5(BIAS)
NetC39_1: C39.1 C40.2 L3.1 U10.1(SW) U10.2(SW)
NetC40_1: C40.1 U10.3(CBOOT)
NetC43_2: C43.2 R31.2 R35.1 TP12.1 U10.9(FB)
NetC49_2: C49.2 U10.4(VCC)
NetC50_1: C50.1 U10.11(SS/TRK)
NetC51_1: C51.1 R33.2 U10.5(BIAS)
NetR27_2: R27.2 U8.8(PGOOD)
NetR29_2: R29.2 U8.7(RT)
NetR34_2: R34.2 U10.8(PGOOD)
NetR36_2: R36.2 U10.7(RT)

### Notes on the sheet
- R25 and R30 form a voltage divider used for cutoff voltage. If the voltage on the ENABLE pin is lower than 2.2V the LM43603 will shut down. R25 can be changed to a higher value to increase the cutoff voltage.
- 2.2V Threshold
- The jumper is used to select between the on board regulator and an external regulator
- R32 and R37 form a voltage divider used for cutoff voltage. If the voltage on the ENABLE pin is lower than 2.2V the LM43603 will shut down. R32 can be changed to a higher value to increase the cutoff voltage.
- Sheet Title:
- ProjectTitle:
- Size:
- Date:
- A
- Number:
- Rev:
- Sheet         of
- Drawn by:

### Library data of the parts
C26 C39 = Cap: Capacitor
C27 C40 = Cap: CAP CER 0.1UF 10V 10% X7R 0402; Manufacturer Part Number: CC0402ZRY5V7BB474; Manufacturer: Yageo; Supplier 1: Digi-Key; Supplier Part Number 1: 311-1735-1-ND; ComponentLink1URL: http://www.yageo.com/documents/recent/UPY-GPHC_Y5V_6.3V-to-50V_5_revised.pdf; ComponentLink1Description: Datasheet
C28 C41 = Cap: Capacitor; Manufacturer Part Number: CL32B106KBJNNNE; Manufacturer: Samsung Electro-Mechanics America, Inc.; Supplier 1: Digi-Key; Supplier Part Number 1: 1276-3387-1-ND; ComponentLink1URL: http://www.samsungsem.com/global/support/library/product-catalog/__icsFiles/afieldfile/2014/11/13/MLCC.pdf; ComponentLink1Description: Datasheet
C29 C42 = Cap: Capacitor; Manufacturer Part Number: CL32B475KBUYNNE; Manufacturer: Samsung Electro-Mechanics America, Inc.; Supplier 1: Digi-Key; Supplier Part Number 1: 1276-1292-1-ND; ComponentLink1URL: http://media.digikey.com/pdf/Data%20Sheets/Samsung%20PDFs/CL32B475KBUYNNE_Spec.pdf; ComponentLink1Description: Datasheet
C30 C43 = Cap: CAP CER 0.1UF 10V 10% X7R 0402; Manufacturer: Yageo; Manufacturer Part Number: CC0402JRNPO9BN101; Supplier 1: Digi-Key; Supplier Part Number 1: 311-1024-1-ND; ComponentLink1URL: http://www.yageo.com/documents/recent/UPY-GP_NP0_16V-to-50V_10.pdf; ComponentLink1Description: Datasheet
C31 C32 C44 C45 = Cap: Capacitor; Manufacturer: Murata Electronics North America; Manufacturer Part Number: GRM32ER71A476KE15L; Supplier 1: Digi-Key; Supplier Part Number 1: 490-5312-1-ND; ComponentLink1URL: http://www.murata.com/~/media/webrenewal/support/library/catalog/products/capacitor/mlcc/c02e.ashx; ComponentLink1Description: Datasheet
C33 C46 = Cap: Capacitor; Manufacturer Part Number: CC0805KKX5R7BB106; Manufacturer: Yageo; Supplier 1: Digi-Key; Supplier Part Number 1: 311-1865-1-ND; ComponentLink1URL: http://www.yageo.com/documents/recent/UPY-GPHC_X5R_4V-to-50V_19.pdf; ComponentLink1Description: Datasheet
C34 C47 = Cap: Capacitor; Manufacturer Part Number: CC0603KPX7R7BB104; Manufacturer: Yageo; Supplier 1: Digi-Key; Supplier Part Number 1: 311-1335-1-ND; ComponentLink1URL: http://www.yageo.com/documents/recent/UPY-GPHC_X7R_6.3V-to-50V-v12.pdf; ComponentLink1Description: Datasheet
C35 C48 = Cap: Capacitor; Manufacturer: Yageo; Manufacturer Part Number: CC0402KRX7R6BB104; Supplier 1: Digi-Key; Supplier Part Number 1: 311-1345-1-ND; ComponentLink1URL: http://www.yageo.com/documents/recent/UPY-GPHC_X7R_6.3V-to-50V-v12.pdf; ComponentLink1Description: Datasheet
C36 C49 = CAP: Capacitor; Manufacturer: Yageo; Manufacturer Part Number: CC0402MRX5R5BB225; Supplier 1: Digi-Key; Supplier Part Number 1: 311-1442-1-ND; ComponentLink1URL: http://www.yageo.com/documents/recent/UPY-GPHC_X5R_4V-to-50V_19.pdf; ComponentLink1Description: Datasheet
C37 C50 = Cap: Capacitor; Manufacturer: Yageo; Manufacturer Part Number: CC0402KRX7R7BB103; ComponentLink1URL: http://www.yageo.com/documents/recent/UPY-GPHC_X7R_6.3V-to-50V-v12.pdf; ComponentLink1Description: Datasheet; Supplier 1: Digi-Key; Supplier Part Number 1: 311-1042-1-ND
C38 C51 = Cap: Capacitor; Manufacturer: Yageo; Manufacturer Part Number: CC0402MRX5R6BB475; Supplier 1: Digi-Key; Supplier Part Number 1: 311-1734-1-ND; ComponentLink1URL: http://www.yageo.com/documents/recent/UPY-GPHC_X5R_4V-to-50V_19.pdf; ComponentLink1Description: Datasheet
JP5 JP6 = Jumper_2
L2 L3 = Inductor: FIXED IND 6.8UH 7A 33.4 MOHM SMD; Manufacturer: Vishay Dale; Value: 6.8uH; Supplier 1: Digi-Key; ComponentLink1URL: http://www.vishay.com/docs/34313/ihlp3232dz11.pdf; ComponentLink1Description: Datasheet; Supplier Part Number 1: 541-1355-1-ND
R24 R31 = RES: Resistor; Manufacturer: Rohm Semiconductor; Manufacturer Part Number: MCR01MRTF1004; Supplier 1: Digi-Key; Supplier Part Number 1: RHM1.00MCDCT-ND; ComponentLink1URL: http://rohmfs.rohm.com/en/products/databook/datasheet/passive/resistor/chip_resistor/mcr_g.pdf; ComponentLink1Description: Datasheet
R25 R32 = RES: Resistor; Manufacturer: Yageo; Manufacturer Part Number: RC0603FR-07453KL; Supplier 1: Digi-Key; Supplier Part Number 1: 311-453KHRCT-ND; ComponentLink1URL: http://www.yageo.com/NewPortal/yageodocoutput?fileName=/pdf/R-Chip/PYu-RC_Group_51_RoHS_L_3.pdf; ComponentLink1Description: Datasheet
R26 R33 = RES: Resistor; Manufacturer Part Number: RC0402JR-070RL; Manufacturer: Yageo; Supplier 1: Digi-Key; Supplier Part Number 1: 311-0.0JRCT-ND; ComponentLink1URL: http://www.yageo.com/NewPortal/yageodocoutput?fileName=/pdf/R-Chip/PYu-RC_Group_51_RoHS_L_3.pdf; ComponentLink1Description: Datasheet
R27 R34 = RES: Resistor; Manufacturer: Yageo; Manufacturer Part Number: RC0402FR-07100KL; Supplier 1: Digi-Key; Supplier Part Number 1: 311-100KLRCT-ND; ComponentLink1URL: http://www.yageo.com/NewPortal/yageodocoutput?fileName=/pdf/R-Chip/PYu-RC_Group_51_RoHS_L_3.pdf; ComponentLink1Description: Datasheet
R28 R35 = RES: Resistor; Manufacturer: Rohm Semiconductor; Manufacturer Part Number: MCR01MRTF2493; Supplier 1: Digi-Key; Supplier Part Number 1: RHM249KCDCT-ND; ComponentLink1URL: http://rohmfs.rohm.com/en/products/databook/datasheet/passive/resistor/chip_resistor/mcr_g.pdf; ComponentLink1Description: Datasheet
R29 R36 = RES: Resistor
R30 R37 = RES: Resistor; Manufacturer: Yageo; Manufacturer Part Number: RC0603FR-07100KL; Supplier 1: Digi-Key; Supplier Part Number 1: 311-100KHRCT-ND; ComponentLink1URL: http://www.yageo.com/NewPortal/yageodocoutput?fileName=/pdf/R-Chip/PYu-RC_Group_51_RoHS_L_3.pdf; ComponentLink1Description: Datasheet
TP10-TP13 = Test Point SIG: Test Point Signal
U8 U10 = LM43603PWPT: Simple Switcher 3.5V to 36V 3A Synchronous Step-Down Voltage Converter; Manufacturer: Texas Instruments; Supplier 1: Digi-Key; Supplier Part Number 1: 296-37755-1-ND; ComponentLink1URL: http://www.ti.com/lit/ds/symlink/lm43603.pdf; ComponentLink1Description: Datasheet; Current - Output: 3A; Voltage - Input (Max): 36V; Manufacturer Part Number: LM43603PWPT; Voltage - Input (Min): 3.5V
U9 U11 = D24V__F_: Pololu Buck Converter D24V__F_ series; ComponentLink1Description: Datasheet; ComponentLink1URL: http://www.pololu.com/product/2851; Manufacturer: Pololu; Supplier 1: Pololu; Supplier Part Number 1: D24V50FX

## Sheet Backup Power.SchDoc
size A; DocumentNumber: 13; SheetNumber: 13; SheetTotal: 16
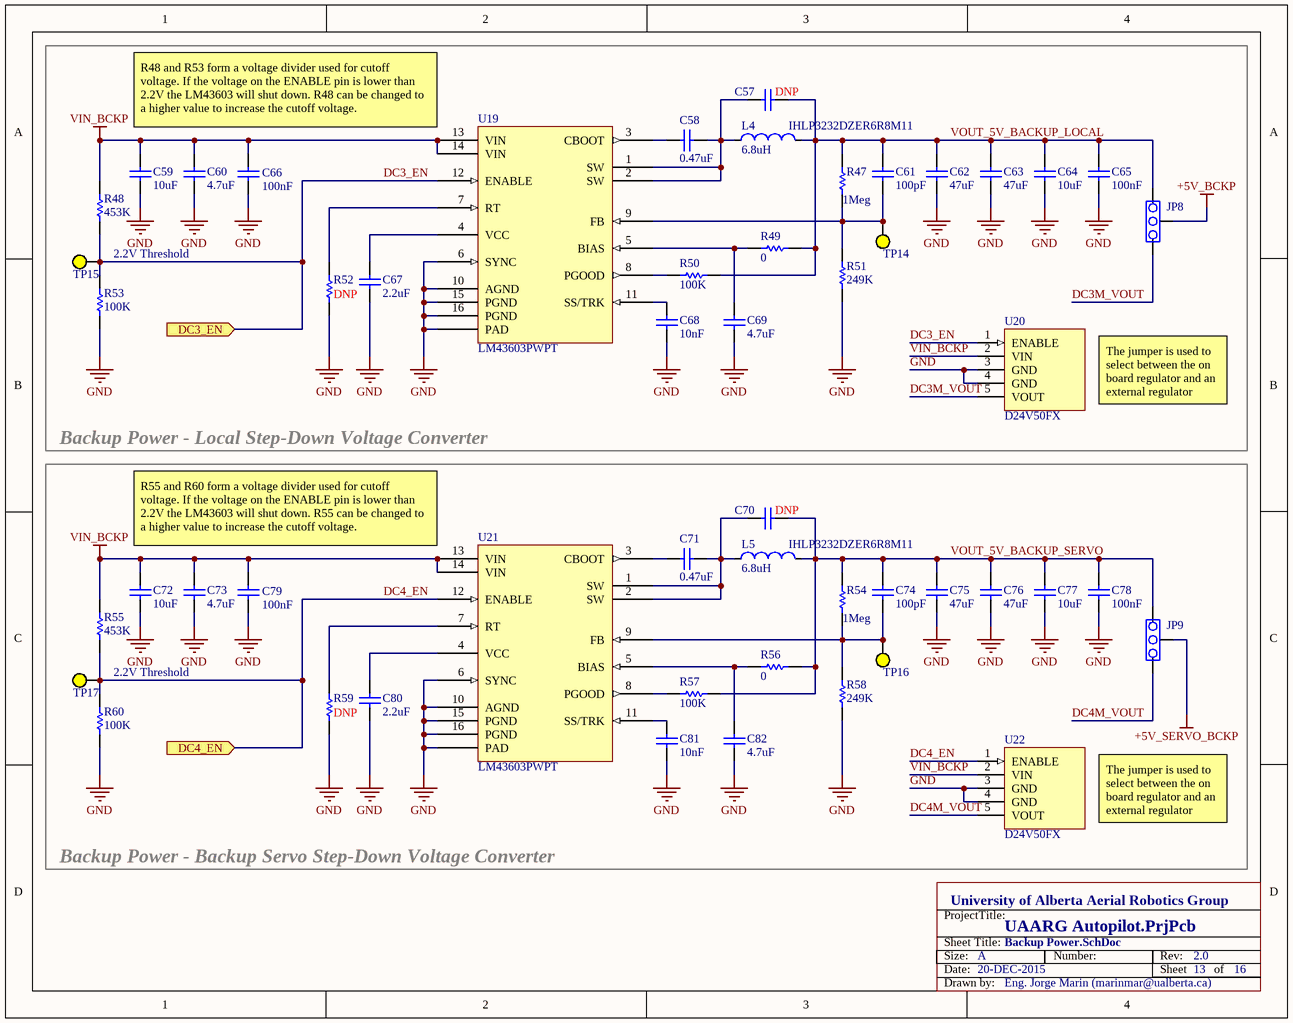
[diagram p15: Backup Power.SchDoc]

### Parts
C57  Note: DNP  [CAP_0402[1005M]]  (hidden comment: Cap)
C58  value 0.47uF  [CAP_0402[1005M]]  (hidden comment: Cap)
C59  value 10uF  [CAP_1210[3225M]]  (hidden comment: Cap)
C60  value 4.7uF  [CAP_1210[3225M]]  (hidden comment: Cap)
C61  value 100pF  [CAP_0402[1005M]]  (hidden comment: Cap)
C62  value 47uF  [CAP_1210[3225M]]  (hidden comment: Cap)
C63  value 47uF  [CAP_1210[3225M]]  (hidden comment: Cap)
C64  value 10uF  [CAP_0805[2012M]]  (hidden comment: Cap)
C65  value 100nF  [CAP_0603[1608M]]  (hidden comment: Cap)
C66  value 100nF  [CAP_0402[1005M]]  (hidden comment: Cap)
C67  value 2.2uF  [CAP_0402[1005M]]  (hidden comment: CAP)
C68  value 10nF  [CAP_0402[1005M]]  (hidden comment: Cap)
C69  value 4.7uF  [CAP_0402[1005M]]  (hidden comment: Cap)
C70  Note: DNP  [CAP_0402[1005M]]  (hidden comment: Cap)
C71  value 0.47uF  [CAP_0402[1005M]]  (hidden comment: Cap)
C72  value 10uF  [CAP_1210[3225M]]  (hidden comment: Cap)
C73  value 4.7uF  [CAP_1210[3225M]]  (hidden comment: Cap)
C74  value 100pF  [CAP_0402[1005M]]  (hidden comment: Cap)
C75  value 47uF  [CAP_1210[3225M]]  (hidden comment: Cap)
C76  value 47uF  [CAP_1210[3225M]]  (hidden comment: Cap)
C77  value 10uF  [CAP_0805[2012M]]  (hidden comment: Cap)
C78  value 100nF  [CAP_0603[1608M]]  (hidden comment: Cap)
C79  value 100nF  [CAP_0402[1005M]]  (hidden comment: Cap)
C80  value 2.2uF  [CAP_0402[1005M]]  (hidden comment: CAP)
C81  value 10nF  [CAP_0402[1005M]]  (hidden comment: Cap)
C82  value 4.7uF  [CAP_0402[1005M]]  (hidden comment: Cap)
JP8  Jumper  [JUMPER_3POS]  (value not drawn)  (no BOM)
JP9  Jumper  [JUMPER_3POS]  (value not drawn)  (no BOM)
L4  6.8uH  Manufacturer Part Number: IHLP3232DZER6R8M11  [IHLP-3232DZ]
L5  6.8uH  Manufacturer Part Number: IHLP3232DZER6R8M11  [IHLP-3232DZ]
R47  value 1Meg  [RES_0402[1005M]]  (hidden comment: RES)
R48  value 453K  [RES_0603[1608M]]  (hidden comment: RES)
R49  value 0  [JUMPER_RES_0402]  (hidden comment: RES)
R50  value 100K  [RES_0402[1005M]]  (hidden comment: RES)
R51  value 249K  [RES_0402[1005M]]  (hidden comment: RES)
R52  Note: DNP  [RES_0402[1005M]]  (hidden comment: RES)
R53  value 100K  [RES_0603[1608M]]  (hidden comment: RES)
R54  value 1Meg  [RES_0402[1005M]]  (hidden comment: RES)
R55  value 453K  [RES_0603[1608M]]  (hidden comment: RES)
R56  value 0  [JUMPER_RES_0402]  (hidden comment: RES)
R57  value 100K  [RES_0402[1005M]]  (hidden comment: RES)
R58  value 249K  [RES_0402[1005M]]  (hidden comment: RES)
R59  Note: DNP  [RES_0402[1005M]]  (hidden comment: RES)
R60  value 100K  [RES_0603[1608M]]  (hidden comment: RES)
TP14  Test Point SIG  [TP_SMD_1_SILK]  (value not drawn)  (no BOM)
TP15  Test Point SIG  [TP_TH_1_SILK]  (value not drawn)  (no BOM)
TP16  Test Point SIG  [TP_SMD_1_SILK]  (value not drawn)  (no BOM)
TP17  Test Point SIG  [TP_TH_1_SILK]  (value not drawn)  (no BOM)
U19  LM43603PWPT  [HTSSOP-16]
U20  Manufacturer Part Number: D24V50FX  [D24V__F_]  (hidden comment: D24V__F_)
U21  LM43603PWPT  [HTSSOP-16]
U22  Manufacturer Part Number: D24V50FX  [D24V__F_]  (hidden comment: D24V__F_)

### Blocks framed on the sheet
Backup Power - Local Step-Down Voltage Converter: C57-C69 JP8 L4 R47-R53 TP14 TP15 U19 U20
Backup Power - Backup Servo Step-Down Voltage Converter: C70-C82 JP9 L5 R54-R60 TP16 TP17 U21 U22

### Ports
DC3_EN (in), DC4_EN (in)

### Nets
+5V_BCKP: JP8.2
+5V_SERVO_BCKP: JP9.2
GND: C59.2 C60.2 C62.2 C63.2 C64.2 C65.2 C66.2 C67.1 C68.2 C69.2 C72.2 C73.2 C75.2 C76.2 C77.2 C78.2 C79.2 C80.1 C81.2 C82.2 R51.2 R52.1 R53.1 R58.2 R59.1 R60.1 U19.6(SYNC) U19.10(AGND) U19.15(PGND) U19.16(PGND) U19.EP(PAD) U20.3(GND) U20.4(GND) U21.6(SYNC) U21.10(AGND) U21.15(PGND) U21.16(PGND) U21.EP(PAD) U22.3(GND) U22.4(GND)
VIN_BCKP: C59.1 C60.1 C66.1 C72.1 C73.1 C79.1 R48.2 R55.2 U19.13(VIN) U19.14(VIN) U20.2(VIN) U21.13(VIN) U21.14(VIN) U22.2(VIN)
DC3_EN: R48.1 R53.2 R55.1 R60.2 TP15.1 TP17.1 U19.12(ENABLE) U20.1(ENABLE) U21.12(ENABLE) U22.1(ENABLE) ; port DC3_EN, port DC4_EN  [also labelled DC4_EN]  [project net BACKUP_EN]
DC3M_VOUT: JP8.3 U20.5(VOUT)
DC4M_VOUT: JP9.3 U22.5(VOUT)
VOUT_5V_BACKUP_LOCAL: C57.2 C61.1 C62.1 C63.1 C64.1 C65.1 JP8.1 L4.2 R47.1 R49.1 R50.1
VOUT_5V_BACKUP_SERVO: C70.2 C74.1 C75.1 C76.1 C77.1 C78.1 JP9.1 L5.2 R54.1 R56.1 R57.1
NetC57_1: C57.1 C58.2 L4.1 U19.1(SW) U19.2(SW)
NetC58_1: C58.1 U19.3(CBOOT)
NetC61_2: C61.2 R47.2 R51.1 TP14.1 U19.9(FB)
NetC67_2: C67.2 U19.4(VCC)
NetC68_1: C68.1 U19.11(SS/TRK)
NetC69_1: C69.1 R49.2 U19.5(BIAS)
NetC70_1: C70.1 C71.2 L5.1 U21.1(SW) U21.2(SW)
NetC71_1: C71.1 U21.3(CBOOT)
NetC74_2: C74.2 R54.2 R58.1 TP16.1 U21.9(FB)
NetC80_2: C80.2 U21.4(VCC)
NetC81_1: C81.1 U21.11(SS/TRK)
NetC82_1: C82.1 R56.2 U21.5(BIAS)
NetR50_2: R50.2 U19.8(PGOOD)
NetR52_2: R52.2 U19.7(RT)
NetR57_2: R57.2 U21.8(PGOOD)
NetR59_2: R59.2 U21.7(RT)

### Notes on the sheet
- R48 and R53 form a voltage divider used for cutoff voltage. If the voltage on the ENABLE pin is lower than 2.2V the LM43603 will shut down. R48 can be changed to a higher value to increase the cutoff voltage.
- 2.2V Threshold
- The jumper is used to select between the on board regulator and an external regulator
- R55 and R60 form a voltage divider used for cutoff voltage. If the voltage on the ENABLE pin is lower than 2.2V the LM43603 will shut down. R55 can be changed to a higher value to increase the cutoff voltage.
- Sheet Title:
- ProjectTitle:
- Size:
- Date:
- A
- Number:
- Rev:
- Sheet         of
- Drawn by:

### Library data of the parts
C57 C70 = Cap: Capacitor
C58 C71 = Cap: as C27 on sheet Main Power; Supplier 1: Digi-Key; Supplier Part Number 1: 311-1735-1-ND; ComponentLink1URL: http://www.yageo.com/documents/recent/UPY-GPHC_Y5V_6.3V-to-50V_5_revised.pdf; ComponentLink1Description: Datasheet
C59 C72 = Cap: as C28 on sheet Main Power; Supplier 1: Digi-Key; Supplier Part Number 1: 1276-3387-1-ND; ComponentLink1URL: http://www.samsungsem.com/global/support/library/product-catalog/__icsFiles/afieldfile/2014/11/13/MLCC.pdf; ComponentLink1Description: Datasheet
C60 C73 = Cap: as C29 on sheet Main Power; Supplier 1: Digi-Key; Supplier Part Number 1: 1276-1292-1-ND; ComponentLink1URL: http://media.digikey.com/pdf/Data%20Sheets/Samsung%20PDFs/CL32B475KBUYNNE_Spec.pdf; ComponentLink1Description: Datasheet
C61 C74 = Cap: as C30 on sheet Main Power; Supplier 1: Digi-Key; Supplier Part Number 1: 311-1024-1-ND; ComponentLink1URL: http://www.yageo.com/documents/recent/UPY-GP_NP0_16V-to-50V_10.pdf; ComponentLink1Description: Datasheet
C62 C63 C75 C76 = Cap: as C31 on sheet Main Power; Supplier 1: Digi-Key; Supplier Part Number 1: 490-5312-1-ND; ComponentLink1URL: http://www.murata.com/~/media/webrenewal/support/library/catalog/products/capacitor/mlcc/c02e.ashx; ComponentLink1Description: Datasheet
C64 C77 = Cap: as C33 on sheet Main Power; Supplier 1: Digi-Key; Supplier Part Number 1: 311-1865-1-ND; ComponentLink1URL: http://www.yageo.com/documents/recent/UPY-GPHC_X5R_4V-to-50V_19.pdf; ComponentLink1Description: Datasheet
C65 C78 = Cap: as C34 on sheet Main Power; Supplier 1: Digi-Key; Supplier Part Number 1: 311-1335-1-ND; ComponentLink1URL: http://www.yageo.com/documents/recent/UPY-GPHC_X7R_6.3V-to-50V-v12.pdf; ComponentLink1Description: Datasheet
C66 C79 = Cap: as C35 on sheet Main Power; Supplier 1: Digi-Key; Supplier Part Number 1: 311-1345-1-ND; ComponentLink1URL: http://www.yageo.com/documents/recent/UPY-GPHC_X7R_6.3V-to-50V-v12.pdf; ComponentLink1Description: Datasheet
C67 C80 = CAP: as C36 on sheet Main Power; Supplier 1: Digi-Key; Supplier Part Number 1: 311-1442-1-ND; ComponentLink1URL: http://www.yageo.com/documents/recent/UPY-GPHC_X5R_4V-to-50V_19.pdf; ComponentLink1Description: Datasheet
C68 C81 = Cap: as C37 on sheet Main Power; ComponentLink1URL: http://www.yageo.com/documents/recent/UPY-GPHC_X7R_6.3V-to-50V-v12.pdf; ComponentLink1Description: Datasheet; Supplier 1: Digi-Key; Supplier Part Number 1: 311-1042-1-ND
C69 C82 = Cap: as C38 on sheet Main Power; Supplier 1: Digi-Key; Supplier Part Number 1: 311-1734-1-ND; ComponentLink1URL: http://www.yageo.com/documents/recent/UPY-GPHC_X5R_4V-to-50V_19.pdf; ComponentLink1Description: Datasheet
JP8 JP9 = Jumper_2
L4 L5 = Inductor: as L2 on sheet Main Power; Value: 6.8uH; Supplier 1: Digi-Key; ComponentLink1URL: http://www.vishay.com/docs/34313/ihlp3232dz11.pdf; ComponentLink1Description: Datasheet; Supplier Part Number 1: 541-1355-1-ND
R47 R54 = RES: as R24 on sheet Main Power; Supplier 1: Digi-Key; Supplier Part Number 1: RHM1.00MCDCT-ND; ComponentLink1URL: http://rohmfs.rohm.com/en/products/databook/datasheet/passive/resistor/chip_resistor/mcr_g.pdf; ComponentLink1Description: Datasheet
R48 R55 = RES: as R25 on sheet Main Power; ComponentLink1Description: Datasheet; ComponentLink1URL: http://www.yageo.com/NewPortal/yageodocoutput?fileName=/pdf/R-Chip/PYu-RC_Group_51_RoHS_L_3.pdf; Supplier 1: Digi-Key; Supplier Part Number 1: 311-453KHRCT-ND
R49 R56 = RES: as R26 on sheet Main Power; Supplier 1: Digi-Key; Supplier Part Number 1: 311-0.0JRCT-ND; ComponentLink1URL: http://www.yageo.com/NewPortal/yageodocoutput?fileName=/pdf/R-Chip/PYu-RC_Group_51_RoHS_L_3.pdf; ComponentLink1Description: Datasheet
R50 R57 = RES: as R27 on sheet Main Power; Supplier 1: Digi-Key; Supplier Part Number 1: 311-100KLRCT-ND; ComponentLink1URL: http://www.yageo.com/NewPortal/yageodocoutput?fileName=/pdf/R-Chip/PYu-RC_Group_51_RoHS_L_3.pdf; ComponentLink1Description: Datasheet
R51 R58 = RES: as R28 on sheet Main Power; Supplier 1: Digi-Key; Supplier Part Number 1: RHM249KCDCT-ND; ComponentLink1URL: http://rohmfs.rohm.com/en/products/databook/datasheet/passive/resistor/chip_resistor/mcr_g.pdf; ComponentLink1Description: Datasheet
R52 R59 = RES: Resistor
R53 R60 = RES: as R30 on sheet Main Power; ComponentLink1Description: Datasheet; ComponentLink1URL: http://www.yageo.com/NewPortal/yageodocoutput?fileName=/pdf/R-Chip/PYu-RC_Group_51_RoHS_L_3.pdf; Supplier 1: Digi-Key; Supplier Part Number 1: 311-100KHRCT-ND
TP14-TP17 = Test Point SIG: Test Point Signal
U19 U21 = LM43603PWPT: as U8 on sheet Main Power; Supplier 1: Digi-Key; Supplier Part Number 1: 296-37755-1-ND; ComponentLink1URL: http://www.ti.com/lit/ds/symlink/lm43603.pdf; ComponentLink1Description: Datasheet; Current - Output: 3A; Voltage - Input (Max): 36V; Manufacturer Part Number: LM43603PWPT; Voltage - Input (Min): 3.5V
U20 U22 = D24V__F_: Pololu Buck Converter D24V__F_ series; ComponentLink1Description: Datasheet; ComponentLink1URL: http://www.pololu.com/product/2851; Manufacturer: Pololu; Supplier 1: Pololu; Supplier Part Number 1: D24V50FX